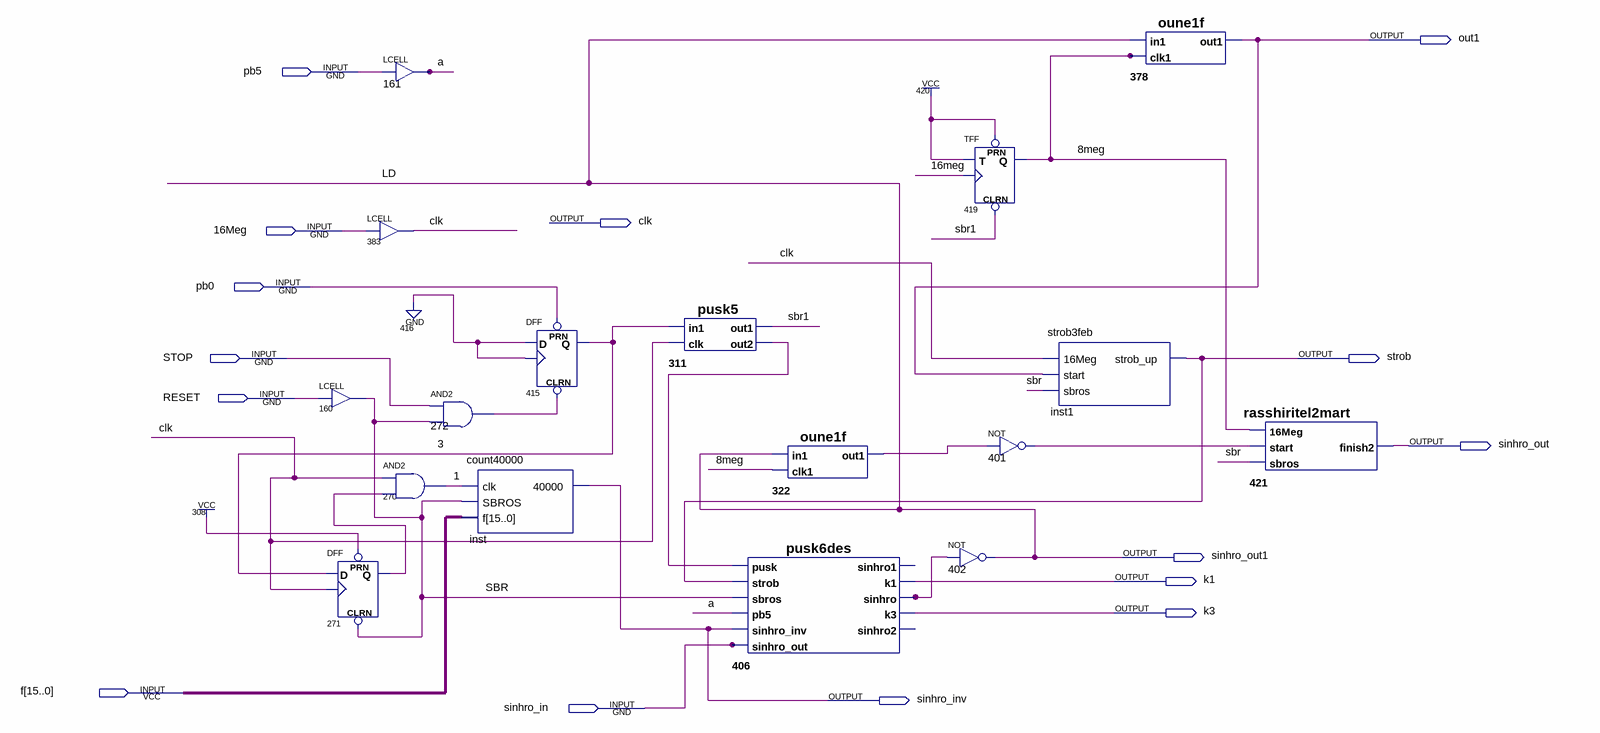
[diagram p0: schematic sheet]
// Quartus schematic program3128NOV28.bdf as structural Verilog: 17 symbols, 15 pins
module program3128NOV28 (
  input  pb5,
  input  \16Meg ,
  input  pb0,
  input  STOP,
  input  RESET,
  input  [15:0] f,
  input  sinhro_in,
  output out1,
  output clk,
  output strob,
  output sinhro_out,
  output sinhro_out1,
  output k1,
  output k3,
  output sinhro_inv
);

  wire \1 , \3 , \8meg , a, n271_q, n272_out, n311_out2, n322_out1, n401_out, n406_sinhro, sbr, sbr1;

  LCELL u_160 (.IN(RESET), .OUT(sbr));
  DFF u_271 (.CLRN(sbr), .CLK(clk), .D(\3 ), .PRN(1'b1), .Q(n271_q));
  LCELL u_161 (.IN(pb5), .OUT(a));
  LCELL u_383 (.IN(\16Meg ), .OUT(clk));
  and u_270 (\1 , clk, n271_q);
  and u_272 (n272_out, STOP, sbr);
  count40000 inst (.clk(\1 ), .SBROS(sbr), .f(f), .\40000 (sinhro_inv));
  DFF u_415 (.CLRN(n272_out), .CLK(1'b0), .D(1'b0), .PRN(pb0), .Q(\3 ));
  pusk5 u_311 (.in1(\3 ), .clk(clk), .out1(sbr1), .out2(n311_out2));
  oune1f u_322 (.in1(sinhro_out1), .clk1(\8meg ), .out1(n322_out1));
  pusk6des u_406 (
    .pusk(n311_out2), .strob(strob), .sbros(sbr), .pb5(a), .sinhro_inv(sinhro_inv), .sinhro_out(sinhro_in),
    .k1(k1), .sinhro(n406_sinhro), .k3(k3));  // open: sinhro1, sinhro2
  TFF u_419 (.PRN(1'b1), .CLRN(sbr1), .T(1'b1), .CLK(\16Meg ), .Q(\8meg ));
  not u_402 (sinhro_out1, n406_sinhro);
  not u_401 (n401_out, n322_out1);
  strob3feb inst1 (.\16Meg (clk), .start(out1), .sbros(sbr), .strob_up(strob));
  oune1f u_378 (.in1(sinhro_out1), .clk1(\8meg ), .out1(out1));
  rasshiritel2mart u_421 (.\16Meg (\8meg ), .start(n401_out), .sbros(sbr), .finish2(sinhro_out));

  // Other names for the same wires on the sheet: LD = sinhro_out1
endmodule
